# Altium schematic sheet KLogShield_Rev1.SchDoc
size C; PageSetup: Record=PageOptions|CenterHorizontal=True|CenterVertical=True|PrintScale=1.00|XCorrection=1.00|YCorrection=1.00|PrintKind=1|BorderSize=5000000|LeftOffset=0|BottomOffset=0|Orientation=2|PaperLength=1000|PaperWidth=1000|Scale=100|PaperSource=7|PrintQuality=-3|MediaType=1|DitherType=10|PrintScaleMode=1|PaperKind=A6 4.1 x 5.8 in (105 x 148 mm)|PaperIndex=260
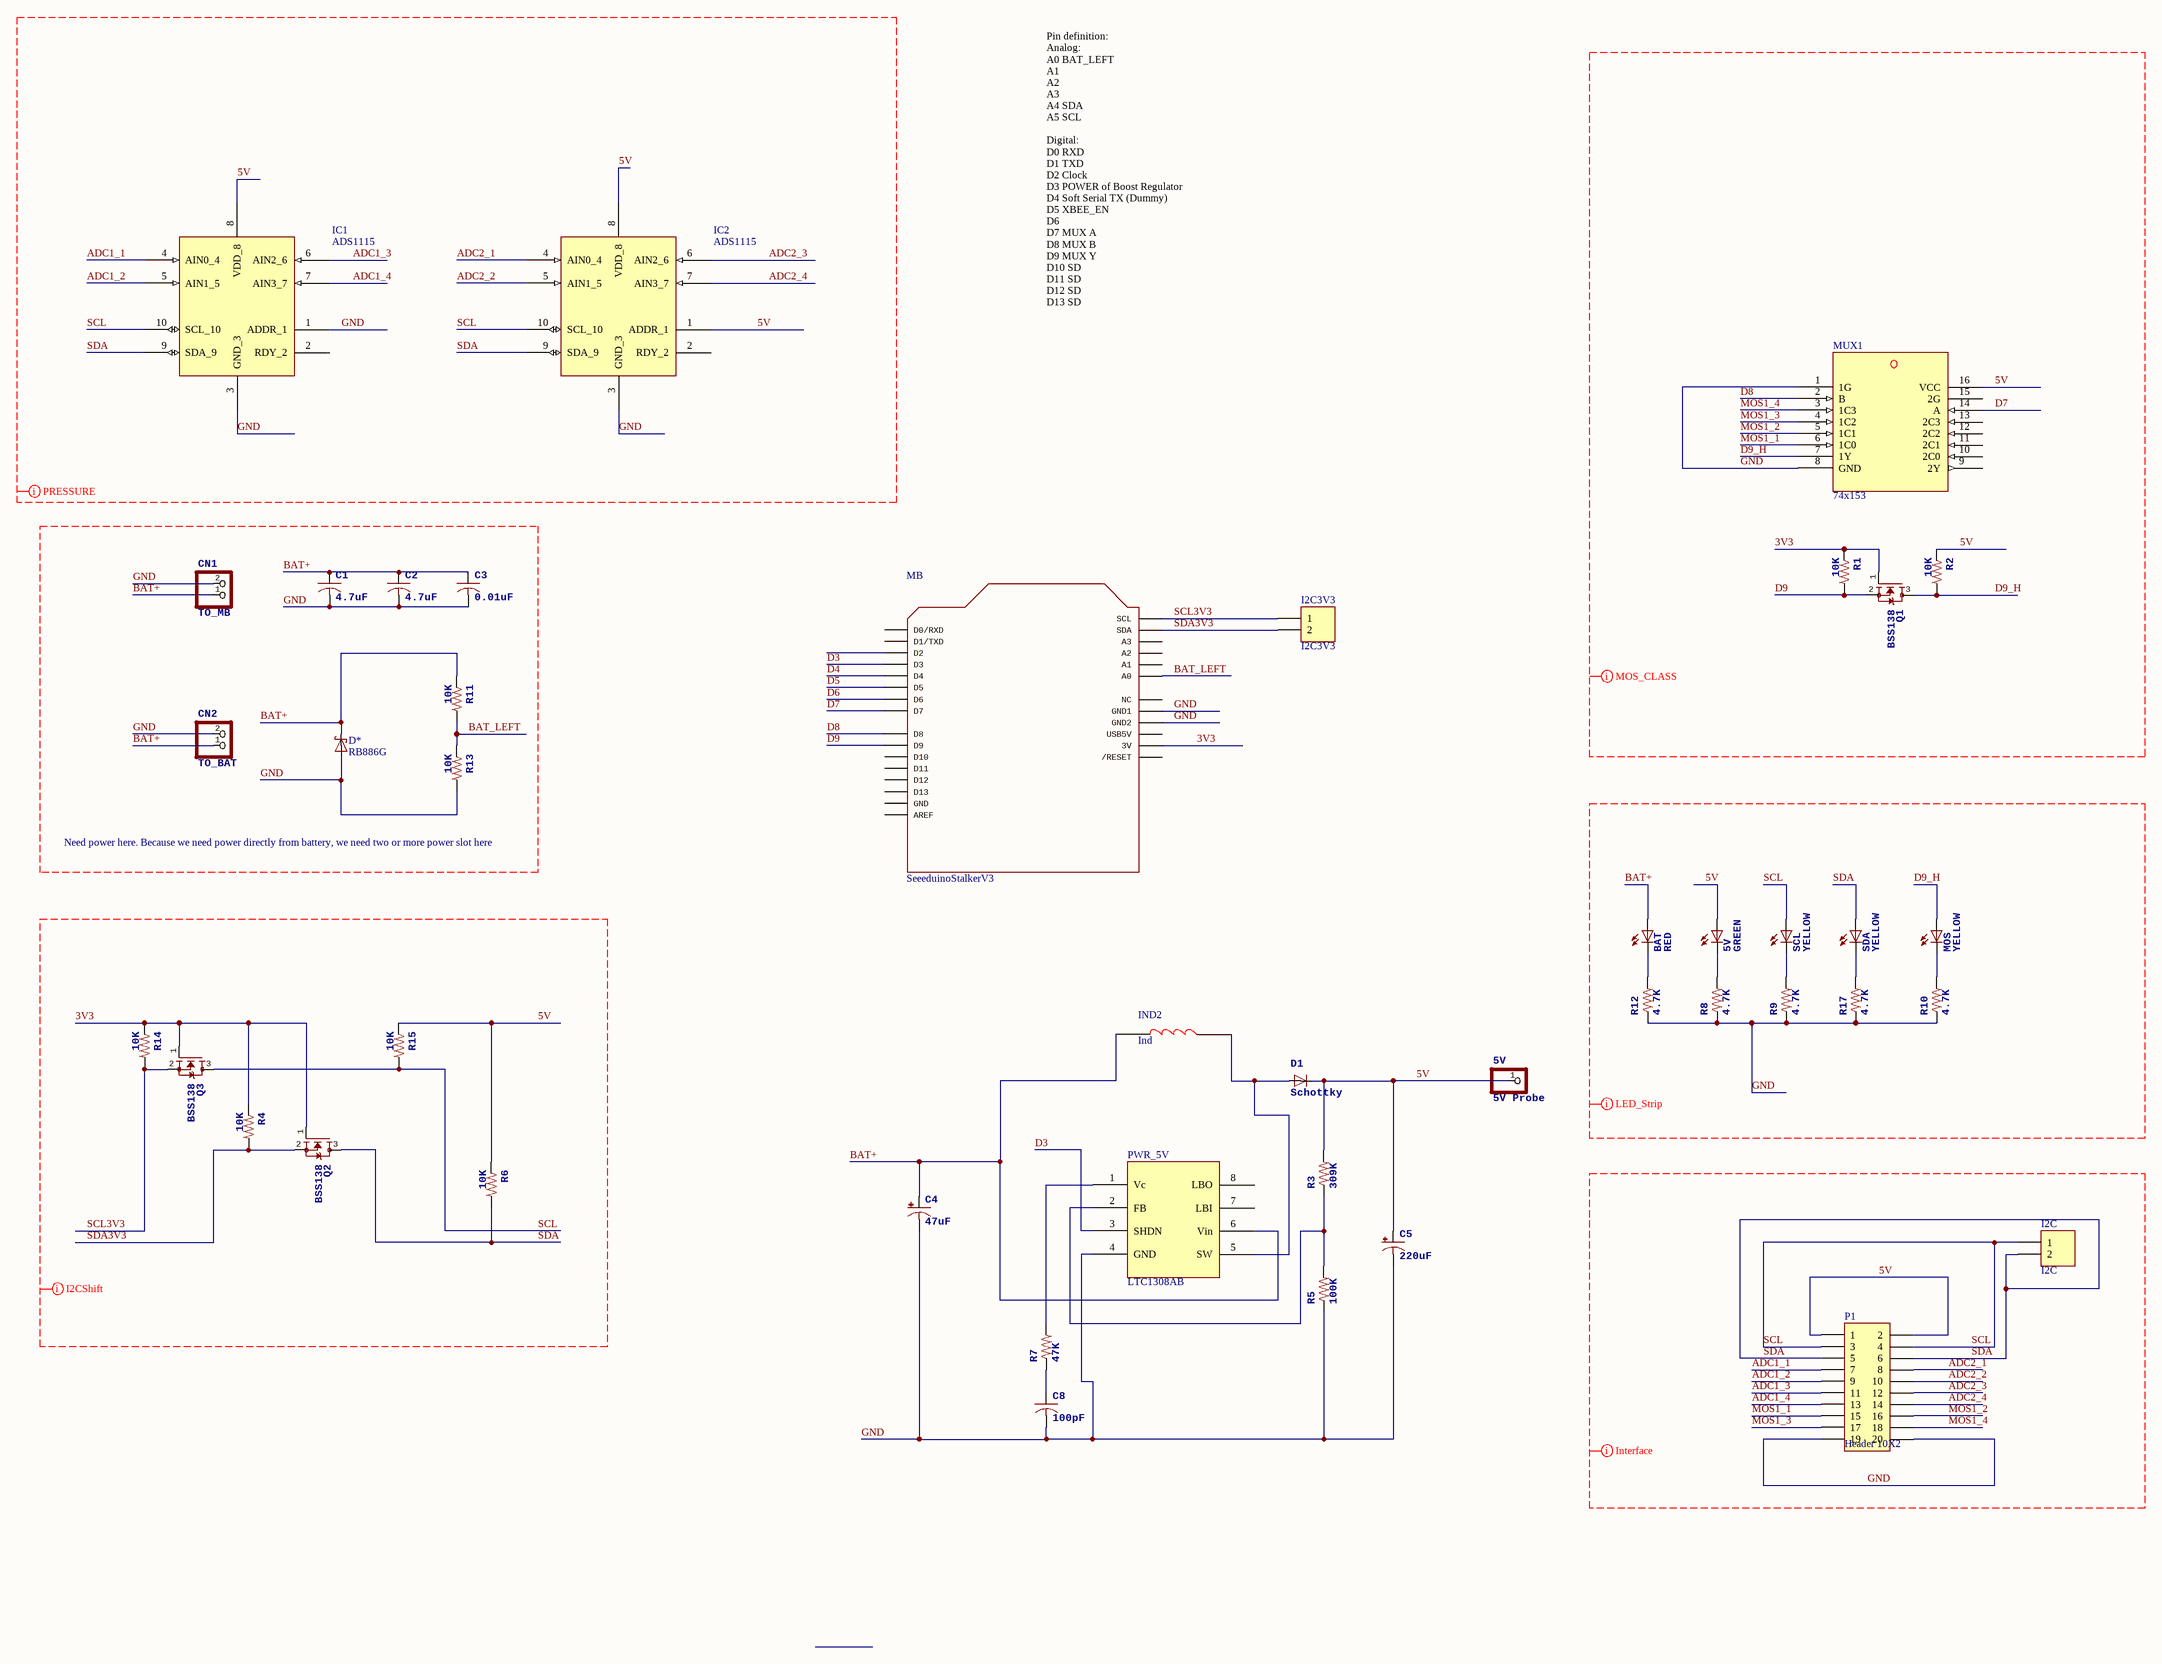
[diagram p0: KLogShield_Rev1.SchDoc]

## Parts
(Parts that share a designator on the sheet are numbered #1, #2 ... from top to bottom, then left to right.)
5V#1  GREEN  [CHIPLED_0805]
5V#2  5V Probe  [1X01]
BAT  RED  [CHIPLED_0805]
C1  4.7uF  [C1210]
C2  4.7uF  [C1210]
C3  0.01uF  [C0805]
C4  47uF  [PANASONIC_C]
C5  220uF  [PANASONIC_D]
C8  100pF  [C0805]
CN1  TO_MB  [JST-PH-2-THM-RA]
CN2  TO_BAT  [JST-PH-2-THM-RA]
D1  Schottky  [SOD-123]
D*  RB886G  [RB886G]
I2C  I2C  [HDR1X2]
I2C3V3  I2C3V3  [HDR1X2]
IC1  ADS1115  [10-VSSOP]
IC2  ADS1115  [10-VSSOP]
IND2  Ind  [M0805]
MB  SeeeduinoStalkerV3  [SeeeduinoStalkrV3]
MOS  YELLOW  [CHIPLED_0805]
MUX1  74x153  [SO16]
P1  Header 10X2  [HDR2X10]
PWR_5V  LTC1308AB  [SO08]
Q1  BSS138  [SOT23]
Q2  BSS138  [SOT23]
Q3  BSS138  [SOT23]
R1  10K  [M0805]
R2  10K  [M0805]
R3  309K  [M0805]
R4  10K  [M0805]
R5  100K  [M0805]
R6  10K  [M0805]
R7  47K  [M0805]
R8  4.7K  [M0805]
R9  4.7K  [M0805]
R10  4.7K  [M0805]
R11  10K  [M0805]
R12  4.7K  [M0805]
R13  10K  [M0805]
R14  10K  [M0805]
R15  10K  [M0805]
R17  4.7K  [M0805]
SCL  YELLOW  [CHIPLED_0805]
SDA  YELLOW  [CHIPLED_0805]

## Nets
3V3: MB.3V Q1.1(G) Q2.1(G) Q3.1(G) R1.1 R4.1 R14.1
5V: 5V#1.A 5V#2.1 C5.+ D1.C IC1.8(VDD_8) IC2.1(ADDR_1) IC2.8(VDD_8) MUX1.16(VCC) P1.1 P1.2 R2.1 R3.2 R6.1 R15.1
ADC1_1: IC1.4(AIN0_4) P1.7
ADC1_2: IC1.5(AIN1_5) P1.9
ADC1_3: IC1.6(AIN2_6) P1.11
ADC1_4: IC1.7(AIN3_7) P1.13
ADC2_1: IC2.4(AIN0_4) P1.8
ADC2_2: IC2.5(AIN1_5) P1.10
ADC2_3: IC2.6(AIN2_6) P1.12
ADC2_4: IC2.7(AIN3_7) P1.14
BAT+: BAT.A C1.1 C2.1 C3.1 C4.+ CN1.1 CN2.1 D*.C IND2.1 PWR_5V.6(Vin) R11.1
BAT_LEFT: MB.A0 R11.2 R13.1
D3: MB.D3 PWR_5V.3(SHDN)
D4: MB.D4
D5: MB.D5
D6: MB.D6
D7: MB.D7 MUX1.14(A)
D8: MB.D8 MUX1.2(B)
D9: MB.D9 Q1.2(S) R1.2
D9_H: MOS.A MUX1.7(1Y) Q1.3(D) R2.2
GND: C1.2 C2.2 C3.2 C4.- C5.- C8.2 CN1.2 CN2.2 D*.A IC1.1(ADDR_1) IC1.3(GND_3) IC2.3(GND_3) MB.GND1 MB.GND2 MUX1.1(1G) MUX1.8(GND) P1.19 P1.20 PWR_5V.4(GND) R5.1 R8.1 R9.1 R10.1 R12.1 R13.2 R17.1
MOS1_1: MUX1.6(1C0) P1.15
MOS1_2: MUX1.5(1C1) P1.16
MOS1_3: MUX1.4(1C2) P1.17
MOS1_4: MUX1.3(1C3) P1.18
SCL: I2C.1 IC1.10(SCL_10) IC2.10(SCL_10) P1.3 P1.4 Q3.3(D) R15.2 SCL.A
SCL3V3: I2C3V3.1 MB.A5SCL(SCL) Q3.2(S) R14.2
SDA: I2C.2 IC1.9(SDA_9) IC2.9(SDA_9) P1.5 P1.6 Q2.3(D) R6.2 SDA.A
SDA3V3: I2C3V3.2 MB.A4SDA(SDA) Q2.2(S) R4.2
Net5V#1_C: 5V#1.C R8.2
NetBAT_C: BAT.C R12.2
NetC8_1: C8.1 R7.1
NetD1_A: D1.A IND2.2 PWR_5V.5(SW)
NetMOS_C: MOS.C R10.2
NetPWR_5V_1: PWR_5V.1(Vc) R7.2
NetPWR_5V_2: PWR_5V.2(FB) R3.1 R5.2
NetR9_2: R9.2 SCL.C
NetR17_2: R17.2 SDA.C

Not connected (* = marked no-connect by the designer): IC1 2(RDY_2); IC2 2(RDY_2); MB 5V(USB5V) A1 A2 A3 AREF D0(D0/RXD) D1(D1/TXD) D2 D10 D11 D12 D13 GND NC RESET(/RESET); MUX1 9(2Y) 10(2C0) 11(2C1) 12(2C2) 13(2C3) 15(2G); PWR_5V 7(LBI) 8(LBO)

## Layout directives
net class pressure: 5V, ADC1_1, ADC1_2, ADC1_3, ADC1_4, ADC2_1, ADC2_2, ADC2_3, ADC2_4, GND, SCL, SDA
net class temperature: 3V3, 5V, SCL, SCL3V3, SDA, SDA3V3
net class Undefined: 3V3, 5V, ADC1_1, ADC1_2, ADC1_3, ADC1_4, ADC2_1, ADC2_2, ADC2_3, ADC2_4, BAT+, D7, D8, D9, D9_H, GND, MOS1_1, MOS1_2, MOS1_3, MOS1_4, SCL, SDA

## Notes on the sheet
- Pin definition:
  Analog:
  A0 BAT_LEFT
  A1
  A2
  A3
  A4 SDA
  A5 SCL
  Digital:
  D0 RXD
  D1 TXD
  D2 Clock
  D3 POWER of Boost Regulator
  D4 Soft Serial TX (Dummy)
  D5 XBEE_EN
  D6
  D7 MUX A
  D8 MUX B
  D9 MUX Y
  D10 SD
  D11 SD
  D12 SD
  D13 SD
- Need power here. Because we need power directly from battery, we need two or more power slot here

## Library data of the parts
5V#1 BAT MOS SCL SDA = LEDCHIPLED_0805
5V#2 = PINHD-1X1
C1 C2 = C-USC1005
C3 C8 = C-USC0805
C4 C5 = CPOL-USD
CN1 CN2 = JST_2PIN-THM-RA
D1 = DIODESOD-123
I2C I2C3V3 = Header 2: Header, 2-Pin; LatestRevisionDate: 17-Jul-2002; LatestRevisionNote: Re-released for DXP Platform.; Publisher: Altium Limited
IC1 IC2 = ADS1115: vendor: TI
P1 = Header 10X2: Header, 10-Pin, Dual row; LatestRevisionDate: 17-Jul-2002; LatestRevisionNote: Re-released for DXP Platform.; Publisher: Altium Limited
Q1-Q3 = MOSFET-NREFLOW
R1-R15 R17 = R-US_M0805